# Altium schematic sheet power_ic.SchDoc
size A4; SheetNumber: 6; SheetTotal: 6
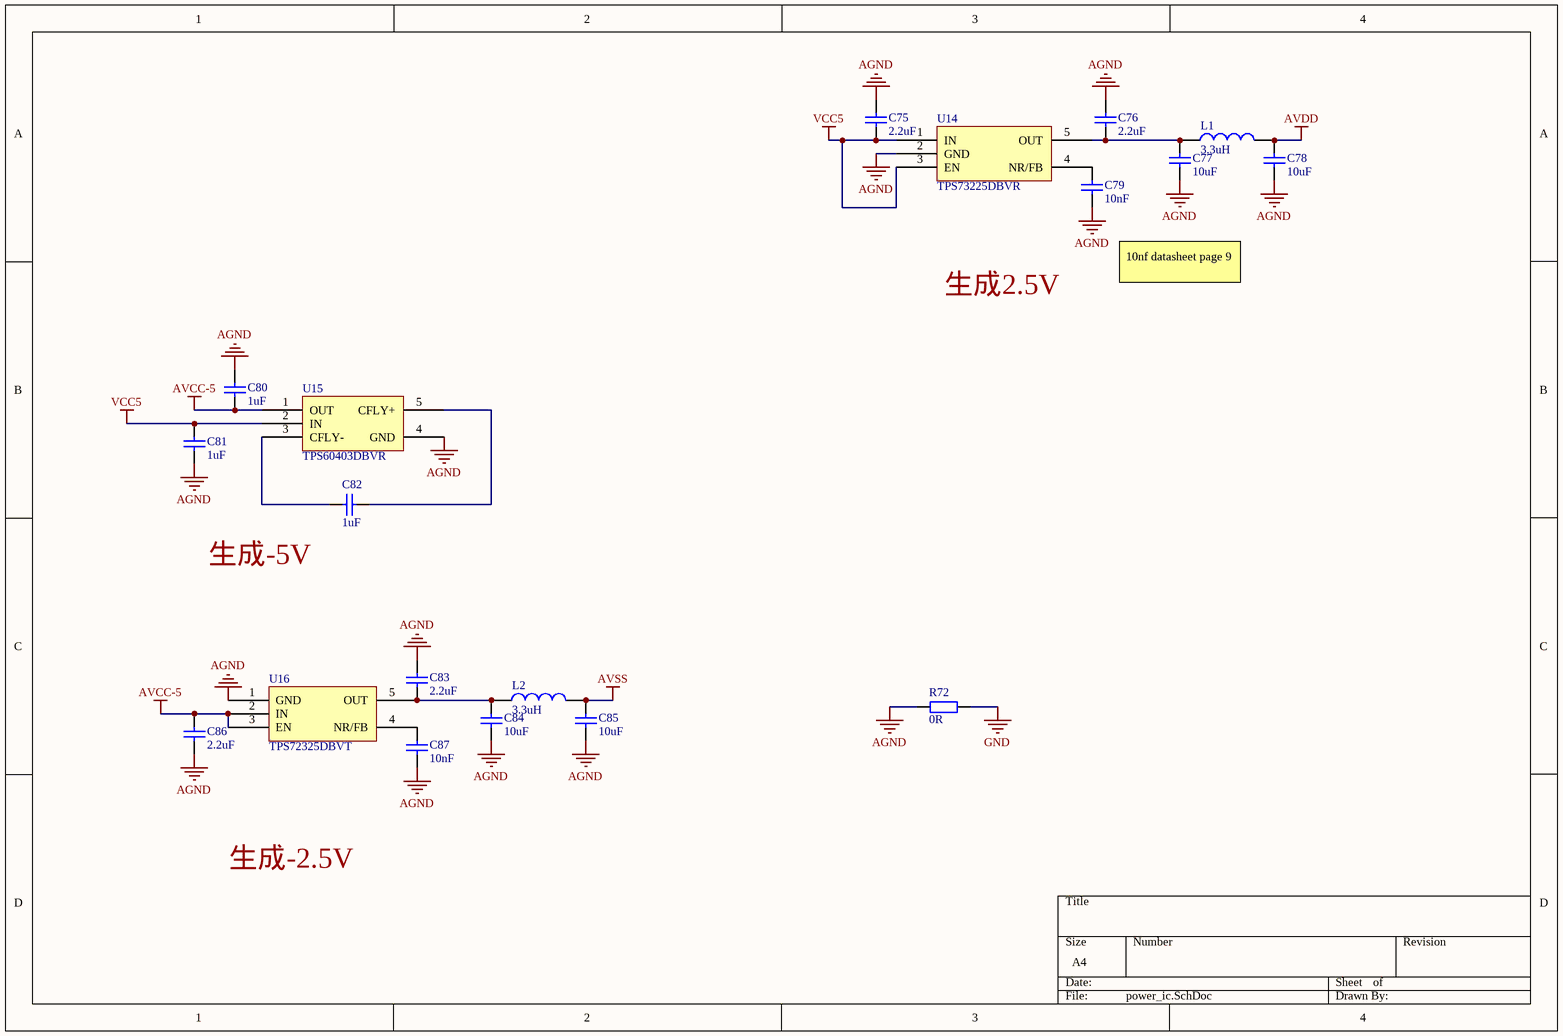
[diagram p0: power_ic.SchDoc]

## Parts
C75  2.2uF  [C0603_L]
C76  2.2uF  [C0603_L]
C77  10uF  [C0603_L]
C78  10uF  [C0603_L]
C79  10nF  [C0603_L]
C80  1uF  [C0603_L]
C81  1uF  [C0603_L]
C82  1uF  [C0603_L]
C83  2.2uF  [C0603_L]
C84  10uF  [C0603_L]
C85  10uF  [C0603_L]
C86  2.2uF  [C0603_L]
C87  10nF  [C0603_L]
L1  3.3uH  [L0805]
L2  3.3uH  [L0805]
R72  0R  [R1206_L]
U14  TPS73225DBVR  [SOT23-5]
U15  TPS60403DBVR  [SOT23-5]
U16  TPS72325DBVT  [SOT23-5]

## Nets
AGND: C75.1 C76.1 C77.2 C78.2 C79.2 C80.2 C81.1 C83.1 C84.2 C85.2 C86.1 C87.2 R72.1 U14.2(GND) U15.4(GND) U16.1(GND)
AVCC-5: C80.1 C86.2 U15.1(OUT) U16.2(IN) U16.3(EN)
AVDD: C78.1 L1.2
AVSS: C85.1 L2.2
GND: R72.2
VCC5: C75.2 C81.2 U14.1(IN) U14.3(EN) U15.2(IN)
NetC76_2: C76.2 C77.1 L1.1 U14.5(OUT)
NetC79_1: C79.1 U14.4(NR/FB)
NetC82_1: C82.1 U15.3(CFLY-)
NetC82_2: C82.2 U15.5(CFLY+)
NetC83_2: C83.2 C84.1 L2.1 U16.5(OUT)
NetC87_1: C87.1 U16.4(NR/FB)

## Notes on the sheet
- 生成2.5V
- 10nf datasheet page 9
- 生成-5V
- 生成-2.5V

## Library data of the parts
C75-C87 = C: 贴片电容/MLCC电容; BOM名称: 无极性贴片电容; 联系下单店铺卖家 免费帮你查找封装: 联系下单店铺卖家 免费技术指导
L1 L2 = L: 贴片小功率电感; BOM名称: 小功率贴片电感; 联系下单店铺卖家 免费帮你查找封装: 联系下单店铺卖家 免费技术指导; jlc_id: C162585
R72 = R: 贴片电阻; 联系下单店铺卖家 免费帮你查找封装: 联系下单店铺卖家 免费技术指导; BOM名称: 贴片电阻
U14 = TPS73225DBVR: 2.5V输出LDO 30uVRMS 精度1%
U15 = TPS60403DBVR: 60mA 充电泵电压反向器 250khz
U16 = TPS72325DBVT: 200mA 负输出低压降线性稳压器 5-SOT-23 -40 to 125; jlc_id: C2864241